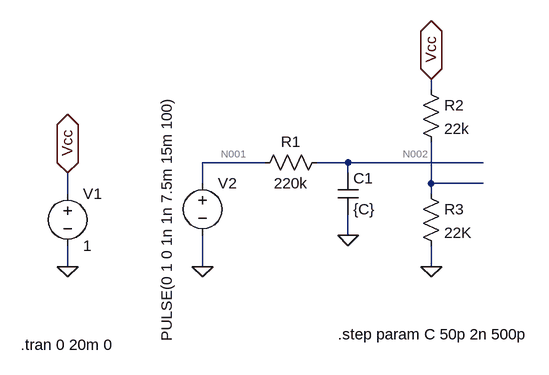
[diagram p0: schematic Draft1.asc]
Draft1.asc, the LTspice schematic file:
Version 4
SHEET 1 880 680
WIRE 352 64 352 48
WIRE 96 176 0 176
WIRE 224 176 176 176
WIRE 432 176 224 176
WIRE 224 192 224 176
WIRE 0 208 0 176
WIRE 352 208 352 144
WIRE 432 208 352 208
WIRE -208 224 -208 192
WIRE 352 224 352 208
WIRE 224 288 224 256
WIRE -208 336 -208 304
WIRE 0 336 0 288
WIRE 352 336 352 304
FLAG 224 288 0
FLAG 352 336 0
FLAG -208 336 0
FLAG -208 192 Vcc
IOPIN -208 192 BiDir
FLAG 0 336 0
FLAG 352 48 Vcc
IOPIN 352 48 BiDir
SYMBOL res 192 160 R90
WINDOW 0 0 56 VBottom 2
WINDOW 3 32 56 VTop 2
SYMATTR InstName R1
SYMATTR Value 220k
SYMBOL cap 208 192 R0
SYMATTR InstName C1
SYMATTR Value {C}
SYMBOL res 336 48 R0
SYMATTR InstName R2
SYMATTR Value 22k
SYMBOL res 336 208 R0
SYMATTR InstName R3
SYMATTR Value 22K
SYMBOL voltage -208 208 R0
WINDOW 123 0 0 Left 2
WINDOW 39 0 0 Left 2
SYMATTR InstName V1
SYMATTR Value 1
SYMBOL voltage 0 192 R0
WINDOW 3 -55 -119 VRight 2
WINDOW 123 0 0 Left 2
WINDOW 39 0 0 Left 2
SYMATTR Value PULSE(0 1 0 1n 1n 7.5m 15m 100)
SYMATTR InstName V2
TEXT -280 456 Left 2 !.tran 0 20m 0
TEXT 208 440 Left 2 !.step param C 50p 2n 500p

The netlist it stands for:
* Draft1.asc
R1 N002 N001 220k
C1 N002 0 {C}
R2 Vcc N003 22k
R3 N003 0 22K
V1 Vcc 0 1
V2 N001 0 PULSE(0 1 0 1n 1n 7.5m 15m 100)
.tran 0 20m 0
.step param C 50p 2n 500p
.backanno
.end

* Results of the author's LTspice run, read from the files saved beside the schematic
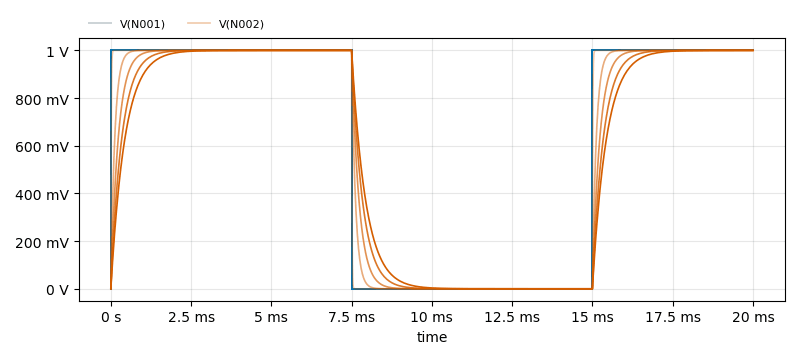
[diagram p1: Transient Analysis of Draft1.asc, plotted from the saved traces]
* Transient Analysis, 5 runs:
*   V(N001) [c=5e-011]: min 0 V, max 1 V, average 625 mV, rms 790.6 mV, last 1 V
*   V(N001) [c=5.5e-010]: min 0 V, max 1 V, average 625 mV, rms 790.6 mV, last 1 V
*   V(N001) [c=1.05e-009]: min 0 V, max 1 V, average 625 mV, rms 790.6 mV, last 1 V
*   V(N001) [c=1.55e-009]: min 0 V, max 1 V, average 625 mV, rms 790.6 mV, last 1 V
*   V(N001) [c=2e-009]: min 0 V, max 1 V, average 625 mV, rms 790.6 mV, last 1 V
*   V(N002) [c=5e-011]: min 0 V, max 1 V, average 624.4 mV, rms 789.7 mV, last 1 V
*   V(N002) [c=5.5e-010]: min 0 V, max 1 V, average 618.9 mV, rms 780.9 mV, last 1 V
*   V(N002) [c=1.05e-009]: min 0 V, max 1 V, average 613.4 mV, rms 772 mV, last 1 V
*   V(N002) [c=1.55e-009]: min 0 V, max 1 V, average 607.9 mV, rms 763.1 mV, last 1 V
*   V(N002) [c=2e-009]: min 0 V, max 1 V, average 602.9 mV, rms 754.9 mV, last 1 V